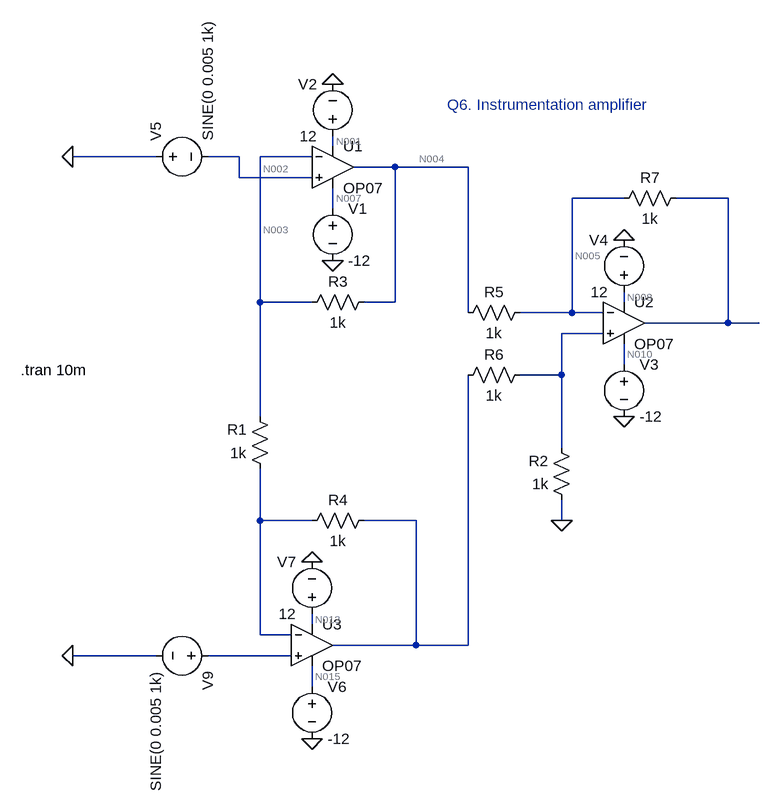
[diagram p0: schematic Instrumentation_Ampli.asc]
Instrumentation_Ampli.asc, the LTspice schematic file:
Version 4
SHEET 1 880 1124
WIRE 208 112 208 96
WIRE -64 128 -192 128
WIRE 64 128 16 128
WIRE 176 128 96 128
WIRE 304 144 240 144
WIRE 416 144 304 144
WIRE 64 160 64 128
WIRE 176 160 64 160
WIRE 656 192 576 192
WIRE 816 192 736 192
WIRE 208 208 208 176
WIRE 96 352 96 128
WIRE 176 352 96 352
WIRE 304 352 304 144
WIRE 304 352 256 352
WIRE 656 352 656 336
WIRE 416 368 416 144
WIRE 576 368 576 192
WIRE 576 368 496 368
WIRE 624 368 576 368
WIRE 816 384 816 192
WIRE 816 384 688 384
WIRE 864 384 816 384
WIRE 624 400 560 400
WIRE 656 448 656 416
WIRE 560 464 560 400
WIRE 560 464 496 464
WIRE 96 528 96 352
WIRE 560 576 560 464
WIRE 96 688 96 608
WIRE 176 688 96 688
WIRE 336 688 256 688
WIRE 560 688 560 656
WIRE 176 848 176 832
WIRE 96 864 96 688
WIRE 144 864 96 864
WIRE 336 880 336 688
WIRE 336 880 208 880
WIRE 416 880 416 464
WIRE 416 880 336 880
WIRE -64 896 -192 896
WIRE 144 896 16 896
WIRE 176 944 176 912
FLAG 208 16 0
FLAG 208 288 0
FLAG 656 256 0
FLAG 656 528 0
FLAG 176 752 0
FLAG 176 1024 0
FLAG -192 896 0
FLAG 560 688 0
FLAG -192 128 0
SYMBOL OpAmps\\OP07 208 80 R0
SYMATTR InstName U1
SYMBOL voltage 208 192 R0
WINDOW 123 0 0 Left 0
WINDOW 39 0 0 Left 0
SYMATTR InstName V1
SYMATTR Value -12
SYMBOL voltage 208 112 R180
WINDOW 0 24 96 Left 2
WINDOW 3 24 16 Left 2
WINDOW 123 0 0 Left 0
WINDOW 39 0 0 Left 0
SYMATTR InstName V2
SYMATTR Value 12
SYMBOL res 512 352 R90
WINDOW 0 0 56 VBottom 2
WINDOW 3 32 56 VTop 2
SYMATTR InstName R5
SYMATTR Value 1k
SYMBOL OpAmps\\OP07 656 320 R0
SYMATTR InstName U2
SYMBOL voltage 656 432 R0
WINDOW 123 0 0 Left 0
WINDOW 39 0 0 Left 0
SYMATTR InstName V3
SYMATTR Value -12
SYMBOL voltage 656 352 R180
WINDOW 0 24 96 Left 2
WINDOW 3 24 16 Left 2
WINDOW 123 0 0 Left 0
WINDOW 39 0 0 Left 0
SYMATTR InstName V4
SYMATTR Value 12
SYMBOL res 272 336 R90
WINDOW 0 0 56 VBottom 2
WINDOW 3 32 56 VTop 2
SYMATTR InstName R3
SYMATTR Value 1k
SYMBOL res 752 176 R90
WINDOW 0 0 56 VBottom 2
WINDOW 3 32 56 VTop 2
SYMATTR InstName R7
SYMATTR Value 1k
SYMBOL res 512 448 R90
WINDOW 0 0 56 VBottom 2
WINDOW 3 32 56 VTop 2
SYMATTR InstName R6
SYMATTR Value 1k
SYMBOL voltage -80 128 R270
WINDOW 123 0 0 Left 0
WINDOW 39 0 0 Left 0
SYMATTR InstName V5
SYMATTR Value SINE(0 0.005 1k)
SYMBOL res 112 624 R180
WINDOW 0 36 76 Left 2
WINDOW 3 36 40 Left 2
SYMATTR InstName R1
SYMATTR Value 1k
SYMBOL OpAmps\\OP07 176 816 R0
SYMATTR InstName U3
SYMBOL voltage 176 928 R0
WINDOW 123 0 0 Left 0
WINDOW 39 0 0 Left 0
SYMATTR InstName V6
SYMATTR Value -12
SYMBOL voltage 176 848 R180
WINDOW 0 24 96 Left 2
WINDOW 3 24 16 Left 2
WINDOW 123 0 0 Left 0
WINDOW 39 0 0 Left 0
SYMATTR InstName V7
SYMATTR Value 12
SYMBOL res 272 672 R90
WINDOW 0 0 56 VBottom 2
WINDOW 3 32 56 VTop 2
SYMATTR InstName R4
SYMATTR Value 1k
SYMBOL res 576 672 R180
WINDOW 0 36 76 Left 2
WINDOW 3 36 40 Left 2
SYMATTR InstName R2
SYMATTR Value 1k
SYMBOL voltage 32 896 R90
WINDOW 123 0 0 Left 0
WINDOW 39 0 0 Left 0
SYMATTR InstName V9
SYMATTR Value SINE(0 0.005 1k)
TEXT -272 456 Left 2 !.tran 10m
TEXT 384 48 Left 2 ;Q6. Instrumentation amplifier

The netlist it stands for:
* Instrumentation_Ampli.asc
XU1 N002 N003 N001 N007 N004 LT1001  ; OP07, pins In+ In- V+ V- OUT
V1 N007 0 -12
V2 N001 0 12
R5 N005 N004 1k
XU2 N009 N005 N008 N010 N006 LT1001  ; OP07, pins In+ In- V+ V- OUT
V3 N010 0 -12
V4 N008 0 12
R3 N004 N003 1k
R7 N006 N005 1k
R6 N009 N012 1k
V5 0 N002 SINE(0 0.005 1k)
R1 N011 N003 1k
XU3 N014 N011 N013 N015 N012 LT1001  ; OP07, pins In+ In- V+ V- OUT
V6 N015 0 -12
V7 N013 0 12
R4 N012 N011 1k
R2 0 N009 1k
V9 N014 0 SINE(0 0.005 1k)
.tran 10m
* Q6. Instrumentation amplifier
.lib LTC.lib
.backanno
.end

* Results of the author's LTspice run, read from the files saved beside the schematic
* Operating Point, zero values left out:
*   V(n001) = 12 V
*   V(n007) = -12 V
*   V(n008) = 12 V
*   V(n010) = -12 V
*   V(n013) = 12 V
*   V(n015) = -12 V
*   I(V1) = 2.25 mA
*   I(V2) = -2.25 mA
*   I(V3) = 2.25 mA
*   I(V4) = -2.25 mA
*   I(V6) = 2.25 mA
*   I(V7) = -2.25 mA
*   Ix(u1:3) = 2.25 mA
*   Ix(u1:4) = -2.25 mA
*   Ix(u2:3) = 2.25 mA
*   Ix(u2:4) = -2.25 mA
*   Ix(u3:3) = 2.25 mA
*   Ix(u3:4) = -2.25 mA
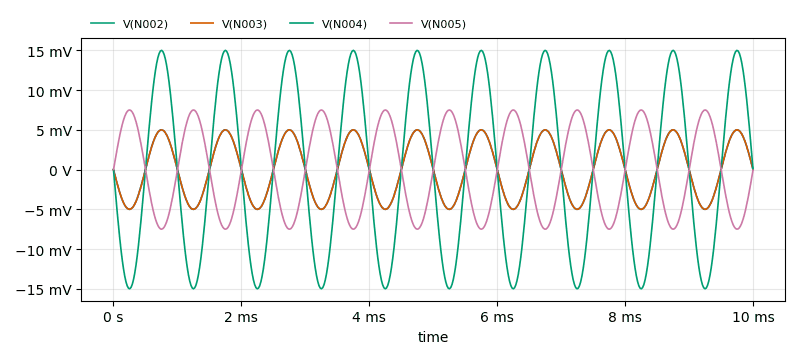
[diagram p1: Transient Analysis of Instrumentation_Ampli.asc, plotted from the saved traces]
* Transient Analysis, 1 run:
*   V(N002): min -5 mV, max 5 mV, average 0 V, rms 3.536 mV, last 0 V
*   V(N003): min -4.995 mV, max 4.995 mV, average -792.7 pV, rms 3.533 mV, last 18.86 µV
*   V(N004): min -14.99 mV, max 14.99 mV, average -2.305 nV, rms 10.6 mV, last 55.98 µV
*   V(N005): min -7.493 mV, max 7.493 mV, average 4.537 nV, rms 5.299 mV, last -63.79 µV